# EAGLE design domino4_EPB (EAGLE 9.6.2)
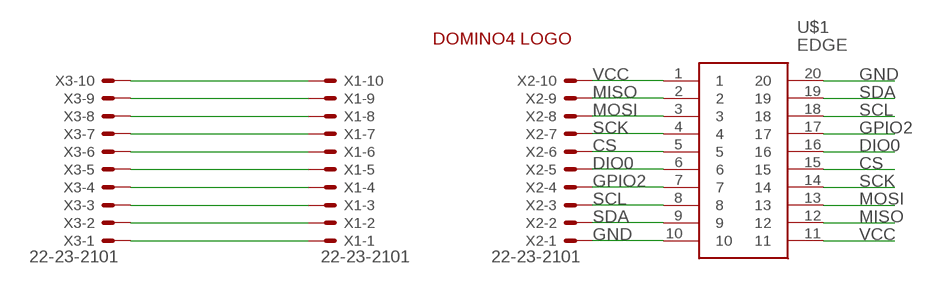
[diagram p0: schematic, sheet 1]

## Parts
U$1  EDGE  [EDGE]
U$2  DOMINO4_LOGO  [DOMINO4_LOGO]
X1  22-23-2101  [22-23-2101]
X2  22-23-2101  [22-23-2101]
X3  22-23-2101  [22-23-2101]

## Nets
CS: U$1.5 U$1.15 X2.6
DIO0: U$1.6 U$1.16 X2.5
GND: U$1.10 U$1.20 X2.1
GPIO2: U$1.7 U$1.17 X2.4
MISO: U$1.2 U$1.12 X2.9
MOSI: U$1.3 U$1.13 X2.8
N$1: X1.10 X3.10
N$2: X1.9 X3.9
N$3: X1.8 X3.8
N$4: X1.7 X3.7
N$5: X1.6 X3.6
N$6: X1.5 X3.5
N$7: X1.4 X3.4
N$8: X1.3 X3.3
N$9: X1.2 X3.2
N$10: X1.1 X3.1
SCK: U$1.4 U$1.14 X2.7
SCL: U$1.8 U$1.18 X2.3
SDA: U$1.9 U$1.19 X2.2
VCC: U$1.1 U$1.11 X2.10

## Library data of the parts
U$1 = 47030-00J191:EDGE
U$2 = 24mm:DOMINO4_LOGO
X1-X3 = 24mm_FPC:22-23-2101: .100" (2.54mm) Center Header - 10 Pin; MF: MOLEX; MPN: 22-23-2101; OC_FARNELL: 1756828; OC_NEWARK: 94C0765

## Board
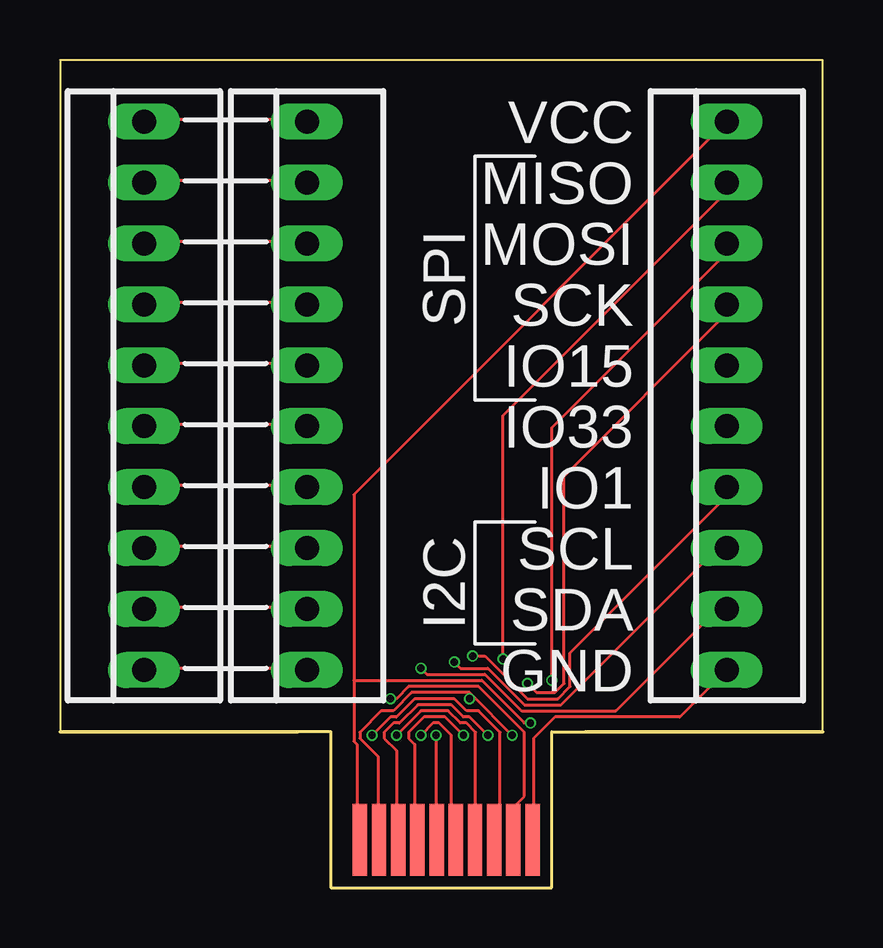
[diagram p1: board, top side]
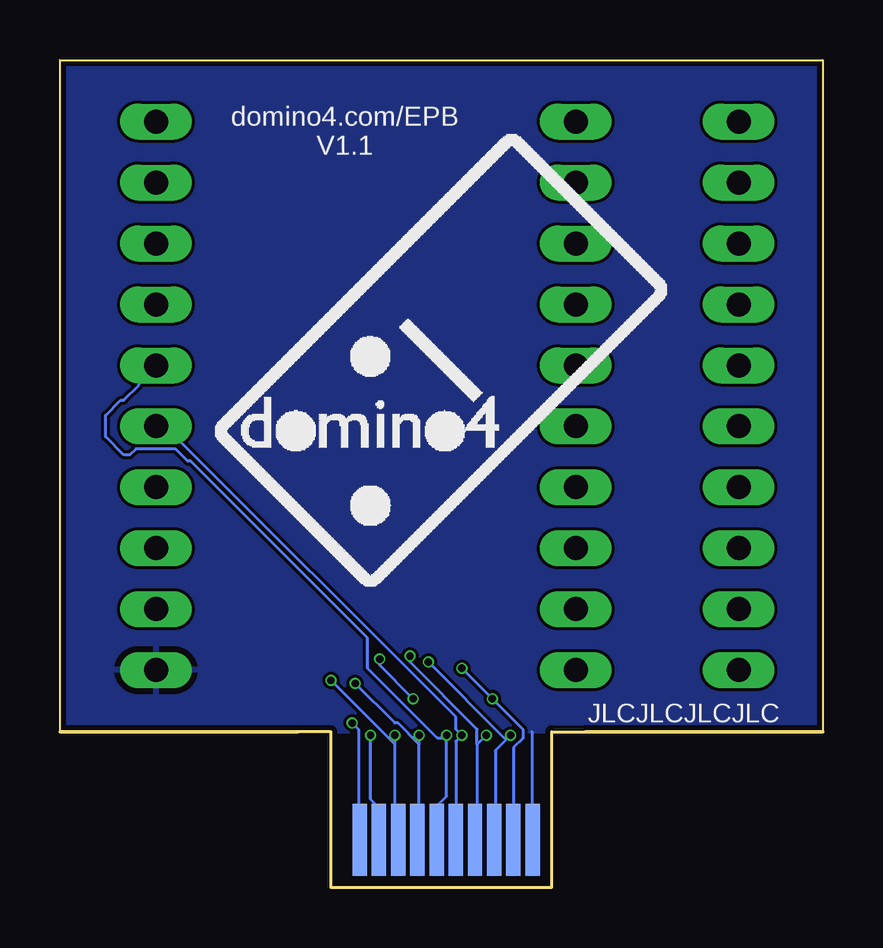
[diagram p2: board, bottom side, seen from below]

Size 31.8 x 34.5 mm. Coordinates in mm from the lower left corner, seen from the top.
Outline: 9.9,6.5 0,6.5 0,34.5 31.8,34.5 31.8,6.5 21.9,6.5
Copper layers (1*16): Top 0.035559375mm / dielectric 1.6mm / Bottom 0.035559375mm
Design rules "jlcpcb2layer": minimum track width 5mil, minimum drill 12mil, track to track 5mil, track to pad 5mil, pad to pad 5mil, via to via 5mil, smd to smd 5mil, copper to edge 8mil, drill to drill 6mil, minimum pad ring 5mil, minimum via ring 3mil, stop-mask expansion 2.5mil, vias tented up to drill 0mil, thermal gap 10mil

### Footprints (pad centres in the part's own frame; a part is rotated, then mirrored left to right if it is on the bottom)
EDGE = smd 0.6 x 3 bottom: 1 3.4,2; 2 2.6,2; 3 1.8,2; 4 1,2; 5 0.2,2; 6 -0.6,2; 7 -1.4,2; 8 -2.2,2; 9 -3,2; 10 -3.8,2 | smd 0.6 x 3: 11 -3.4,2; 12 -2.6,2; 13 -1.8,2; 14 -1,2; 15 -0.2,2; 16 0.6,2; 17 1.4,2; 18 2.2,2; 19 3,2; 20 3.8,2
22-23-2101 = drill 1 long: 1 -11.43,0; 2 -8.89,0; 3 -6.35,0; 4 -3.81,0; 5 -1.27,0; 6 1.27,0; 7 3.81,0; 8 6.35,0; 9 8.89,0; 10 11.43,0

### Placement (x,y rotation side)
U$1  15.9,0 0 top
U$2  15.94,22 0 bottom
U$3  [JLCPCB-ORDER-NO]  5.8,7.28 0 bottom
X1  10.3,20.5 90 top
X2  27.8,20.5 90 top
X3  3.5,20.5 90 top

### Tracks (layer width: path | path; a pad name or v marks a point on that pad's centre or on a via)
CS  (via drill 0.3)
  Top 0.127: v15.68,6.35 15.68,2.03 U$1.15
  Bottom 0.127: 15.68,6.22 15.68,3.81 16.06,3.43 16.06,2.03 U$1.5 | 15.68,6.22 16.06,6.22 18.98,9.14 18.98,10.41 26.35,17.78 26.47,17.78 26.98,18.29 28.63,18.29 28.89,18.03 29.14,18.03 29.9,18.8 29.9,19.68 29.27,20.32 29.14,20.32 28.51,20.95 28.51,21.08 27.87,21.72 X2.6 | 15.68,6.22 v15.68,6.35
DIO0  (via drill 0.3)
  Top 0.127: v15.04,6.35 15.55,6.86 15.81,6.86 16.31,6.35 16.31,2.16 16.44,2.03 U$1.16
  Bottom 0.127: U$1.6 15.3,2.03 15.3,6.1 v15.04,6.35 15.3,6.6 15.3,7.11 27.36,19.18 27.74,19.18 X2.5
GND
  Top 0.127: U$1.20 19.74,2.03 19.74,6.22 20.63,7.11 25.84,7.11 27.74,9.02 X2.1
  Bottom 0.127: 12.12,6.5 12.12,2.03 U$1.10
  pour Bottom: 0,34.5 31.8,34.5 31.8,6.5 0,6.5
GPIO2  (via drill 0.3)
  Top 0.127: v14.03,6.35 15.04,7.37 16.19,7.37 16.7,6.86 16.95,6.86 17.33,6.48 17.33,2.03 U$1.17 | v17.2,9.65 17.71,9.65 19.49,7.87 20.76,7.87 21.27,8.38 21.27,9.78 27.74,16.26 27.74,16.64 X2.4
  Bottom 0.127: 14.41,5.97 14.41,2.03 U$1.7 | v14.03,6.35 14.41,5.97 | v17.2,9.65 17.2,9.4 14.41,6.6 14.41,5.97
MISO  (via drill 0.3)
  Top 0.127: v18.85,6.35 17.2,8 | 17.2,8 17.08,8.13 14.66,8.13 13.9,7.37 13.39,7.37 12.5,6.48 12.5,6.22 13.27,5.46 13.27,2.03 U$1.12 | v18.47,9.53 18.47,19.68 27.74,28.96 27.74,29.34 X2.9 | 17.2,8 v17.08,7.87
  Bottom 0.127: v18.85,6.35 18.85,3.68 18.6,3.43 18.6,2.03 U$1.2 | v18.47,9.53 18.47,9.27 v17.08,7.87
MOSI  (via drill 0.3)
  Top 0.127: v17.84,6.35 17.08,7.11 16.82,7.11 16.31,7.62 14.92,7.62 14.16,6.86 13.9,6.86 13.52,6.48 13.52,6.22 14.03,5.71 14.03,2.03 U$1.13 | v20.51,8.64 20.51,19.18 27.74,26.42 27.74,26.8 X2.8
  Bottom 0.127: 17.84,5.97 17.84,2.16 17.71,2.03 U$1.3 | 17.84,5.97 v17.84,6.35 | 17.84,5.97 v20.51,8.64
N$1
  Top 0.127: X3.10 3.61,32 10.22,32 X1.10
N$2
  Top 0.127: X3.9 3.61,29.46 10.22,29.46 X1.9
N$3
  Top 0.127: X3.8 3.61,26.92 10.22,26.92 X1.8
N$4
  Top 0.127: X3.7 3.61,24.38 10.22,24.38 X1.7
N$5
  Top 0.127: X3.6 3.61,21.84 10.22,21.84 X1.6
N$6
  Top 0.127: X3.5 3.61,19.3 10.22,19.3 X1.5
N$7
  Top 0.127: X3.4 3.61,16.76 10.22,16.76 X1.4
N$8
  Top 0.127: X3.3 3.61,14.22 10.22,14.22 X1.3
N$9
  Top 0.127: X3.2 3.61,11.68 10.22,11.68 X1.2
N$10
  Top 0.127: X3.1 3.61,9.14 10.22,9.14 X1.1
SCK  (via drill 0.3)
  Top 0.127: v16.82,6.35 16.06,7.11 15.17,7.11 14.54,6.48 14.54,6.22 14.79,5.97 14.79,2.03 U$1.14 | v19.49,8.51 19.87,8.13 20.63,8.13 21.01,8.51 21.01,17.14 27.74,23.88 27.74,24.26 X2.7
  Bottom 0.127: 16.82,5.97 16.82,2.03 U$1.4 | 16.82,5.97 v16.82,6.35 | v19.49,8.51 17.84,6.86 17.71,6.86 16.82,5.97
SCL  (via drill 0.3)
  Top 0.127: v13.01,6.35 13.77,7.11 14.03,7.11 14.79,7.87 16.44,7.87 16.95,7.37 17.46,7.37 18.35,6.48 18.35,2.16 18.22,2.03 U$1.18 | v16.44,9.4 16.7,9.14 17.84,9.14 19.36,7.62 20.89,7.62 27.36,14.1 27.74,14.1 X2.3
  Bottom 0.127: 13.14,6.22 13.65,5.71 13.65,2.03 U$1.8 | v16.44,9.4 13.27,6.22 13.14,6.22 | 13.14,6.22 v13.01,6.35
SDA  (via drill 0.3)
  Top 0.127: v13.77,7.87 14.03,7.87 14.54,8.38 17.46,8.38 19.36,6.48 19.36,3.81 18.98,3.43 18.98,2.03 U$1.19 | v15.04,9.14 15.3,8.89 17.71,8.89 19.23,7.37 23.17,7.37 27.36,11.56 27.74,11.56 X2.2
  Bottom 0.127: U$1.9 12.89,2.03 12.89,5.84 12.5,6.22 12.5,6.6 v13.77,7.87 v15.04,9.14
VCC  (via drill 0.3)
  Top 0.127: 12.25,8.64 12.25,16.38 27.74,31.88 X2.10 | 12.25,8.64 12.25,6.1 12.38,5.97 12.38,2.03 U$1.11 | v19.62,6.86 19.36,6.86 17.58,8.64 12.25,8.64
  Bottom 0.127: v19.62,6.86 19.36,6.6 19.36,2.03 U$1.1

### Text on the board
bPlace: domino4.com/EPB / V1.1
tNames: VCC | MISO | MOSI | SPI | SCK | IO15 | IO33 | IO1 | SCL | I2C | SDA | GND